# EAGLE design CPLD_probe (EAGLE 7.2.0)
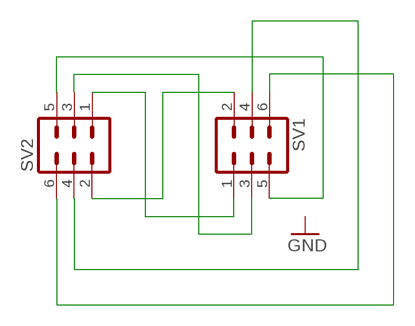
[diagram p0: schematic, sheet 1]

## Parts
SV1  MA03-2  [MA03-2]
SV2  MA03-2  [MA03-2]

## Nets
N$1: SV1.2 SV2.2
N$2: SV1.1 SV2.1
N$3: SV1.3 SV2.3
N$4: SV1.5 SV2.5
N$5: SV1.4 SV2.4
N$6: SV1.6 SV2.6

## Library data of the parts
SV1 SV2 = con-lstb:MA03-2: PIN HEADER; OC_FARNELL: unknown; OC_NEWARK: unknown

## Board
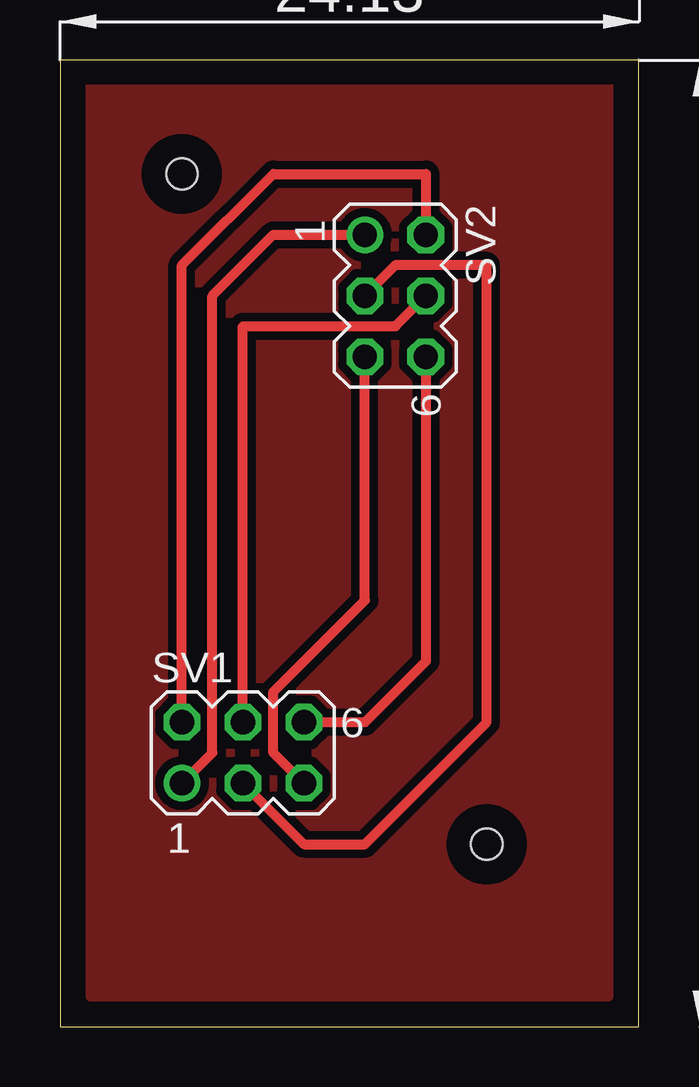
[diagram p1: board, top side]

Size 24.11 x 40.31 mm. Coordinates in mm from the lower left corner, seen from the top.
Outline: 0,0 24.11,0 24.11,40.31 0,40.31 0,0
Copper layers (1*16): Top 0.035mm / dielectric 1.5mm / Bottom 0.035mm
Design rules "default *": minimum track width 14mil, minimum drill 26mil, track to track 14mil, track to pad 14mil, pad to pad 14mil, via to via 14mil, smd to smd 14mil, copper to edge 40mil, drill to drill 8mil, minimum pad ring 10mil, minimum via ring 8mil, stop-mask expansion 4mil, vias tented up to drill 0mil, thermal gap 10mil
Holes 1.3 mm at 17.78,7.62 5.08,35.56

### Footprints (pad centres in the part's own frame; a part is rotated, then mirrored left to right if it is on the bottom)
MA03-2 = drill 1.016: 1 -2.54,-1.27 | drill 1.016 octagon: 2 -2.54,1.27; 3 0,-1.27; 4 0,1.27; 5 2.54,-1.27; 6 2.54,1.27

### Placement (x,y rotation side)
SV1  7.62,11.43 0 top
SV2  13.97,30.48 270 top

### Tracks (layer width: path | path; a pad name or v marks a point on that pad's centre or on a via)
GND
  pour Top: 1.27,39.37 1.27,1.27 22.86,1.27 22.86,39.37
N$1
  Top 0.406: SV1.2 5.08,31.75 8.89,35.56 15.24,35.56 SV2.2
N$2
  Top 0.406: SV1.1 6.35,11.43 6.35,30.48 8.89,33.02 SV2.1
N$3
  Top 0.406: SV1.3 10.16,7.62 12.7,7.62 17.78,12.7 17.78,31.75 13.97,31.75 SV2.3
N$4
  Top 0.406: SV1.5 8.89,11.43 8.89,13.97 12.7,17.78 SV2.5
N$5
  Top 0.406: SV1.4 7.62,29.21 13.97,29.21 SV2.4
N$6
  Top 0.406: SV2.6 15.24,15.24 12.7,12.7 SV1.6